# Altium schematic sheet USB-UART.SchDoc
size A4
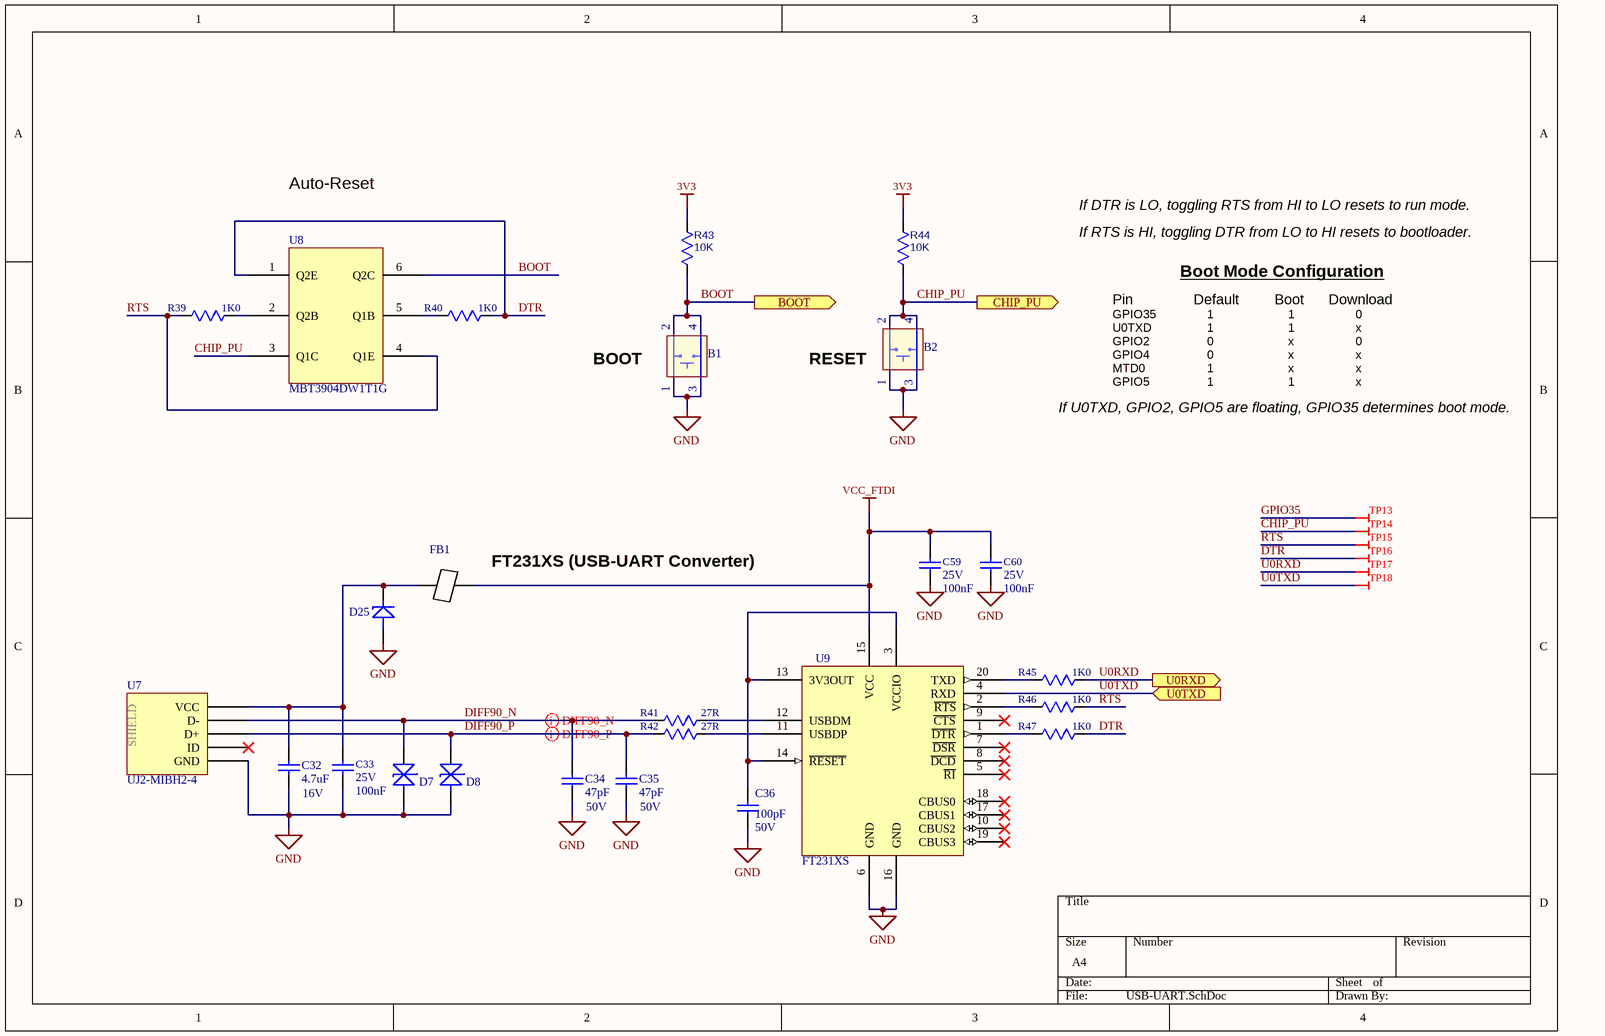
[diagram p0: USB-UART.SchDoc]

## Parts
B1  Button C&K PTS815 SJG 250 SMTR LFS  [PTS 815]  (value not drawn)
B2  Button C&K PTS815 SJG 250 SMTR LFS  [PTS 815]  (value not drawn)
C32  4.7uF  Voltage: 16V  [C1005[0402]]
C33  value 100nF  Voltage: 25V  [CAPC1005X06N]  (hidden comment: 4.7uF)
C34  47pF  Voltage: 50V  [C1005[0402]]
C35  47pF  Voltage: 50V  [C1005[0402]]
C36  Voltage: 50V  [C1005[0402]]  (hidden comment: 100pF)
C59  value 100nF  Voltage: 25V  [CAPC1005X06N]  (hidden comment: 4.7uF)
C60  value 100nF  Voltage: 25V  [CAPC1005X06N]  (hidden comment: 4.7uF)
D7  ESD7951ST5GOSCT-ND  [SODFL100X40-2N]  (value not drawn)
D8  ESD7951ST5GOSCT-ND  [SODFL100X40-2N]  (value not drawn)
D25  5V TVS  [NXP PTVSxS1UR-Series (SOD123W)]  (value not drawn)
FB1  Ferrite Bead  [MI0805K400R-10]  (value not drawn)
R39  1K0  [RESC1005X03N]
R40  1K0  [RESC1005X03N]
R41  27R  [RESC1005X03N]
R42  27R  [RESC1005X03N]
R43  10K  [RESC1005X03N]
R44  10K  [RESC1005X03N]
R45  1K0  [RESC1005X03N]
R46  1K0  [RESC1005X03N]
R47  1K0  [RESC1005X03N]
TP13  PAD  [TP_SMD_39MIL]  (value not drawn)  (no BOM)
TP14  PAD  [TP_SMD_39MIL]  (value not drawn)  (no BOM)
TP15  PAD  [TP_SMD_39MIL]  (value not drawn)  (no BOM)
TP16  PAD  [TP_SMD_39MIL]  (value not drawn)  (no BOM)
TP17  PAD  [TP_SMD_39MIL]  (value not drawn)  (no BOM)
TP18  PAD  [TP_SMD_39MIL]  (value not drawn)  (no BOM)
U7  UJ2-MIBH2-4  [UJ2-MIBH2-4-SMT]
U8  MBT3904DW1T1G  [SOT65P210X110-6N]
U9  FT231XS  [SOP64P1030X175-20N]

## Ports
BOOT (out), CHIP_PU (out), U0RXD (out), U0TXD (in)

## Nets
3V3: R43.2 R44.2
GND: B1.1 B1.3 B2.1 B2.3 C32.1 C33.2 C34.1 C35.1 C36.1 C59.2 C60.2 D7.1(CATHODE) D8.1(CATHODE) D25.2 U7.5(GND) U9.6(GND) U9.16(GND)
VCC_FTDI: C59.1 C60.1 FB1.2 U9.15(VCC)
BOOT: B1.2 B1.4 R43.1 U8.6(Q2C) ; port BOOT
CHIP_PU: B2.2 B2.4 R44.1 TP14.1 U8.3(Q1C) ; port CHIP_PU
DIFF90_N: C34.2 D7.2(ANODE) R41.2 U7.2(D-)
DIFF90_P: C35.2 D8.2(ANODE) R42.2 U7.3(D+)
DTR: R40.2 R47.2 TP16.1 U8.1(Q2E)
GPIO35: TP13.1
RTS: R39.1 R46.2 TP15.1 U8.4(Q1E)
U0RXD: R45.2 TP17.1 ; port U0RXD
U0TXD: TP18.1 U9.4(RXD) ; port U0TXD
NetC32_2: C32.2 C33.1 D25.1 FB1.1 U7.1(VCC)
NetC36_2: C36.2 U9.3(VCCIO) U9.13(3V3OUT) U9.14(~{RESET})
NetR39_2: R39.2 U8.2(Q2B)
NetR40_1: R40.1 U8.5(Q1B)
NetR41_1: R41.1 U9.12(USBDM)
NetR42_1: R42.1 U9.11(USBDP)
NetR45_1: R45.1 U9.20(TXD)
NetR46_1: R46.1 U9.2(~{RTS})
NetR47_1: R47.1 U9.1(~{DTR})

Not connected (* = marked no-connect by the designer): U7 4(ID)*; U9 5(~{RI})* 7(~{DSR})* 8(~{DCD})* 9(~{CTS})* 10(CBUS2)* 17(CBUS1)* 18(CBUS0)* 19(CBUS3)*

## Layout directives
differential pair: DIFF90_N, DIFF90_P

## Notes on the sheet
- Auto-Reset
- If DTR is LO, toggling RTS from HI to LO resets to run mode.
- If RTS is HI, toggling DTR from LO to HI resets to bootloader.
- Pin
- Boot Mode Configuration
- Default
- Boot
- Download
- (near B1) BOOT
- (near B2) RESET
- GPIO35
- U0TXD
- GPIO2
- GPIO4
- MTD0
- GPIO5
- 1
- 0
- x
- If U0TXD, GPIO2, GPIO5 are floating, GPIO35 determines boot mode.
- (near FB1) FT231XS (USB-UART Converter)
- (in symbol USB Shield) SHIELD

## Library data of the parts
B1 B2 = Button C&K PTS815 SJG 250 SMTR LFS: Push Button Top; Manufacturer: C&K Components; Supplier 1: Digi-Key; Manufacturer Part Number: PTS815 SJG 250 SMTR LFS; ComponentLink1URL: http://datasheet.octopart.com/PTS815-SJG-250-SMTR-LFS-C%26K-Components-datasheet-130077068.pdf?src-supplier=Allied+Electronics; ComponentLink1Description: http://datasheet.octopart.com/PTS815-SJG-250-SMTR-LFS-C%26K-Components-datasheet-130077068.pdf?src-supplier=Allied+Electronics; Supplier Part Number 1: CKN12217-1-ND
C32 = 4.7uF_0402_10V: Cap,4.7uF,10V,20%,X5R,0402; Manufacturer: Samsung Electro-Mechanics; Manufacturer Part Number: CL05A475MO5NUNC; Supplier 1: Digi-Key; Supplier Part Number 1: 1276-6836-1-ND; Value: 4.7uF
C33 C59 C60 = 4.7uF_0603_10V: Manufacturer Part Number: CL05A104KA5NNNC; Manufacturer: Samsung; ComponentLink1URL: http://www.murata.com/~/media/webrenewal/support/library/catalog/products/capacitor/mlcc/c02e.pdf; ComponentLink1Description: http://www.murata.com/~/media/webrenewal/support/library/catalog/products/capacitor/mlcc/c02e.pdf; Supplier 1: Digi-Key; Supplier Part Number 1: 1276-1043-1-ND
C34 = 47pF_0402_50V: Cap,47pF,50V,5%,C0G/NP0; Manufacturer: Yageo; Manufacturer Part Number: CC0402JRNPO9BN470; Supplier 1: Digi-Key; Supplier Part Number 1: 311-1021-1-ND; Value: 47pF
C35 = 47pF_0402_50V: Cap,47pF,50V,5%,C0G/NP0; Manufacturer Part Number: CC0402JRNPO9BN470; Manufacturer: Yageo; Supplier 1: Digi-Key; Supplier Part Number 1: 311-1021-1-ND; Value: 47pF
C36 = 100pF_0402_10V: Cap,100pF,10V,5%,C0G/NP0,0402; Manufacturer Part Number: CC0402JRNPO9BN101; Manufacturer: Yageo; Supplier 1: Digi-Key; Supplier Part Number 1: 311-1024-1-ND; Value: 100pF
D7 D8 = ESD7951S: TVS Diode; Manufacturer: ON Semiconductor; Supplier Part Number 1: ESD7951ST5GOSCT-ND; Manufacturer Part Number: ESD7951ST5G; Supplier 1: Digi-Key
D25 = NXP PTVSxS1UR-Series: Manufacturer: Nexperia; Manufacturer Part Number: PTVS5V0S1UR,115; Supplier 1: Digi-Key; Supplier Part Number 1: 1727-5229-1-ND
FB1 = Ferrite Bead: MI0805K400R-10; Manufacturer: Laird; Supplier Part Number 1: 240-2389-1-ND; Manufacturer Part Number: MI0805K400R-10; Supplier 1: Digi-Key
R39 R40 R45-R47 = 1K00_0603_0.1W: RES 1K Ohm ±5%, 0.25W,1/4W 0603; Manufacturer: Panasonic; Manufacturer Part Number: ERJ-2RKF1001X; Supplier 1: Digi-Key; ComponentLink1URL: https://datasheet.ciiva.com/2469/esr-2469603.pdf; ComponentLink1Description: https://datasheet.ciiva.com/2469/esr-2469603.pdf; ComponentLink2URL: https://datasheet.ciiva.com/2469/esr-2469604.pdf; ComponentLink2Description: https://datasheet.ciiva.com/2469/esr-2469604.pdf; ComponentLink3URL: https://datasheet.ciiva.com/2469/esr-2469605.pdf; ComponentLink3Description: https://datasheet.ciiva.com/2469/esr-2469605.pdf; Supplier Part Number 1: P1.00KLCT-ND; Value: 1k
R41 R42 = 1K00_0603_0.1W: RES 1K Ohm ±5%, 0.25W,1/4W 0603; Manufacturer: Panasonic; Manufacturer Part Number: ERJ-2GEJ270X; ComponentLink1URL: https://datasheet.ciiva.com/2469/esr-2469603.pdf; ComponentLink1Description: https://datasheet.ciiva.com/2469/esr-2469603.pdf; ComponentLink2URL: https://datasheet.ciiva.com/2469/esr-2469604.pdf; ComponentLink2Description: https://datasheet.ciiva.com/2469/esr-2469604.pdf; ComponentLink3URL: https://datasheet.ciiva.com/2469/esr-2469605.pdf; ComponentLink3Description: https://datasheet.ciiva.com/2469/esr-2469605.pdf; Supplier 1: Digi-Key; Supplier Part Number 1: P27JCT-ND
R43 R44 = 1K00_0603_0.1W: RES 1K Ohm ±5%, 0.25W,1/4W 0603; Manufacturer: Panasonic; Manufacturer Part Number: ERJ-2RKF1002X; ComponentLink1URL: https://datasheet.ciiva.com/2469/esr-2469603.pdf; ComponentLink1Description: https://datasheet.ciiva.com/2469/esr-2469603.pdf; ComponentLink2URL: https://datasheet.ciiva.com/2469/esr-2469604.pdf; ComponentLink2Description: https://datasheet.ciiva.com/2469/esr-2469604.pdf; ComponentLink3URL: https://datasheet.ciiva.com/2469/esr-2469605.pdf; ComponentLink3Description: https://datasheet.ciiva.com/2469/esr-2469605.pdf; Supplier 1: Digi-Key; Supplier Part Number 1: P10.0KLDKR-ND
TP13-TP18 = TP_SMD_39MIL: SMD Test Pad; Manufacturer: No P/N Required; P/N: No P/N; UM: EA; Fast Supplier: No P/N Required; Fast Supplier P/N: No P/N Required; Manufacturer P/N: No P/N Required
U7 = USB Shield: Manufacturer: CUI; Manufacturer Part Number: UJ2-MIBH2-4-SMT-TR; Supplier Part Number 1: 102-4007-1-ND; Supplier 1: Digi-Key
U8 = MBT3904DW1: Dual NPN Transistors; Manufacturer: ON Semiconductor; Supplier Part Number 1: MBT3904DW1T1GOSCT-ND; Manufacturer Part Number: MBT3904DW1T1G; Supplier 1: Digi-Key
U9 = FT231XS: USB-UART Interface; Manufacturer: FTDI; Manufacturer Part Number: FT231XS-R; Supplier Part Number 1: 768-1129-1-ND; Supplier 1: Digi-Key